# EasyEDA Pro project Series and Parallel Schematic Circuits.eprj

# Schematic Series Circuit
Board Name: Board1; Create Date: 2026-05-08; Page Name: P1; Project Name: Series and Parallel Schematic Circuits; Schematic Name: Series Circuit; Update Date: 2026-05-08; Company: EasyEDA.com; Page Size: A4; Version: V1.0
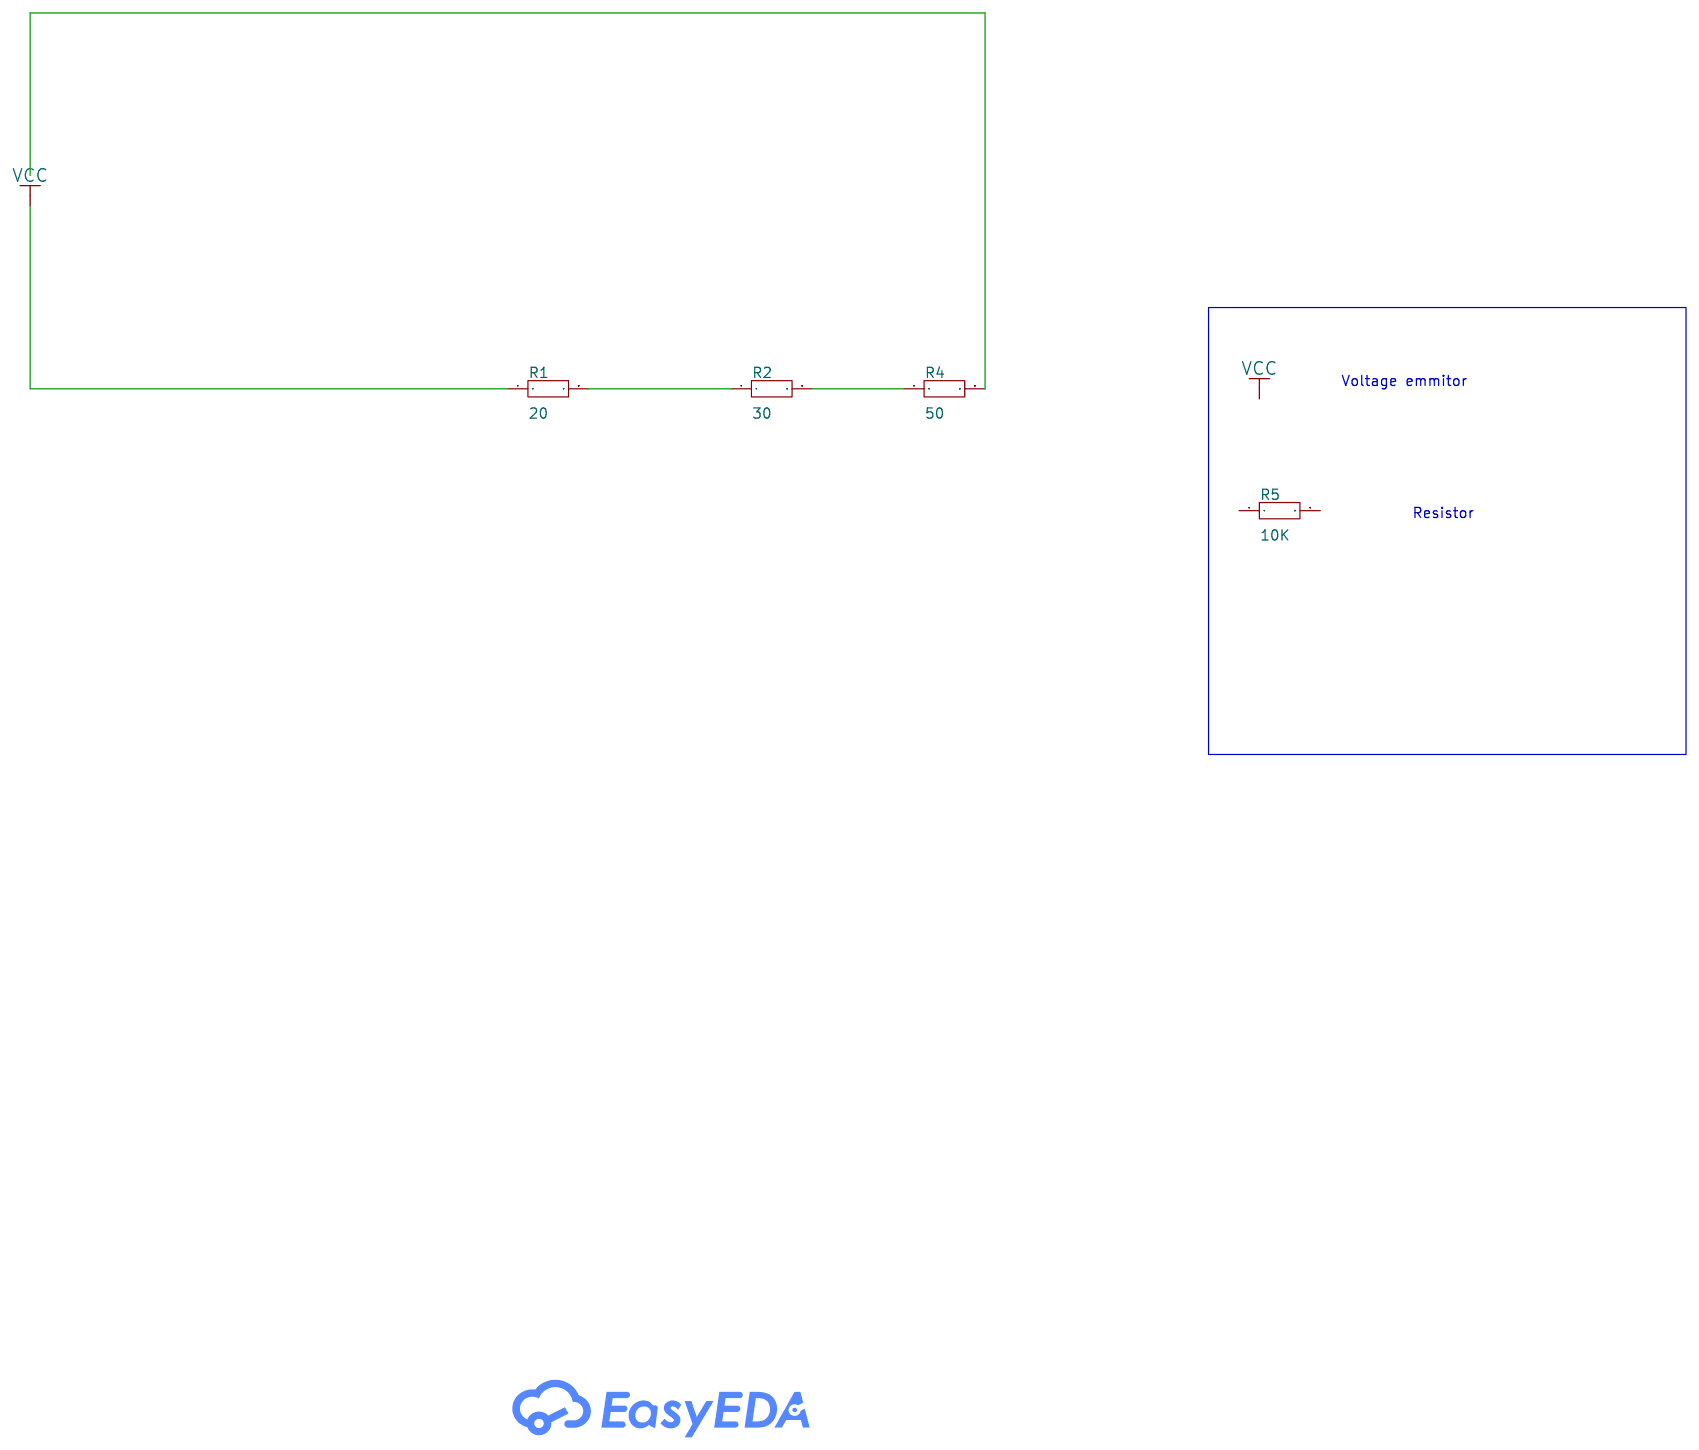
[diagram p0: schematic sheet]

## Parts
R1  20  [R0603]
R2  30  [R0603]
R4  50  [R0603]
R5  10K  [R0603]

## Library data of the parts
R1 R2 R4 R5 = Res_0603: Supplier Footprint: 0603

## Nets
VCC: R1.1
Net-(R1-2): R1.2 R2.1
Net-(R2-2): R2.2 R4.1

Not connected (* = marked no-connect by the designer): R4 2; R5 1 2

## Notes on the sheet
- Voltage emmitor
- Resistor

# Schematic Parallel Circuit
Board Name: Board2; Create Date: 2026-05-08; Page Name: P1; Project Name: Series and Parallel Schematic Circuits; Schematic Name: Parallel Circuit; Update Date: 2026-05-08; Company: EasyEDA.com; Page Size: A4; Version: V1.0
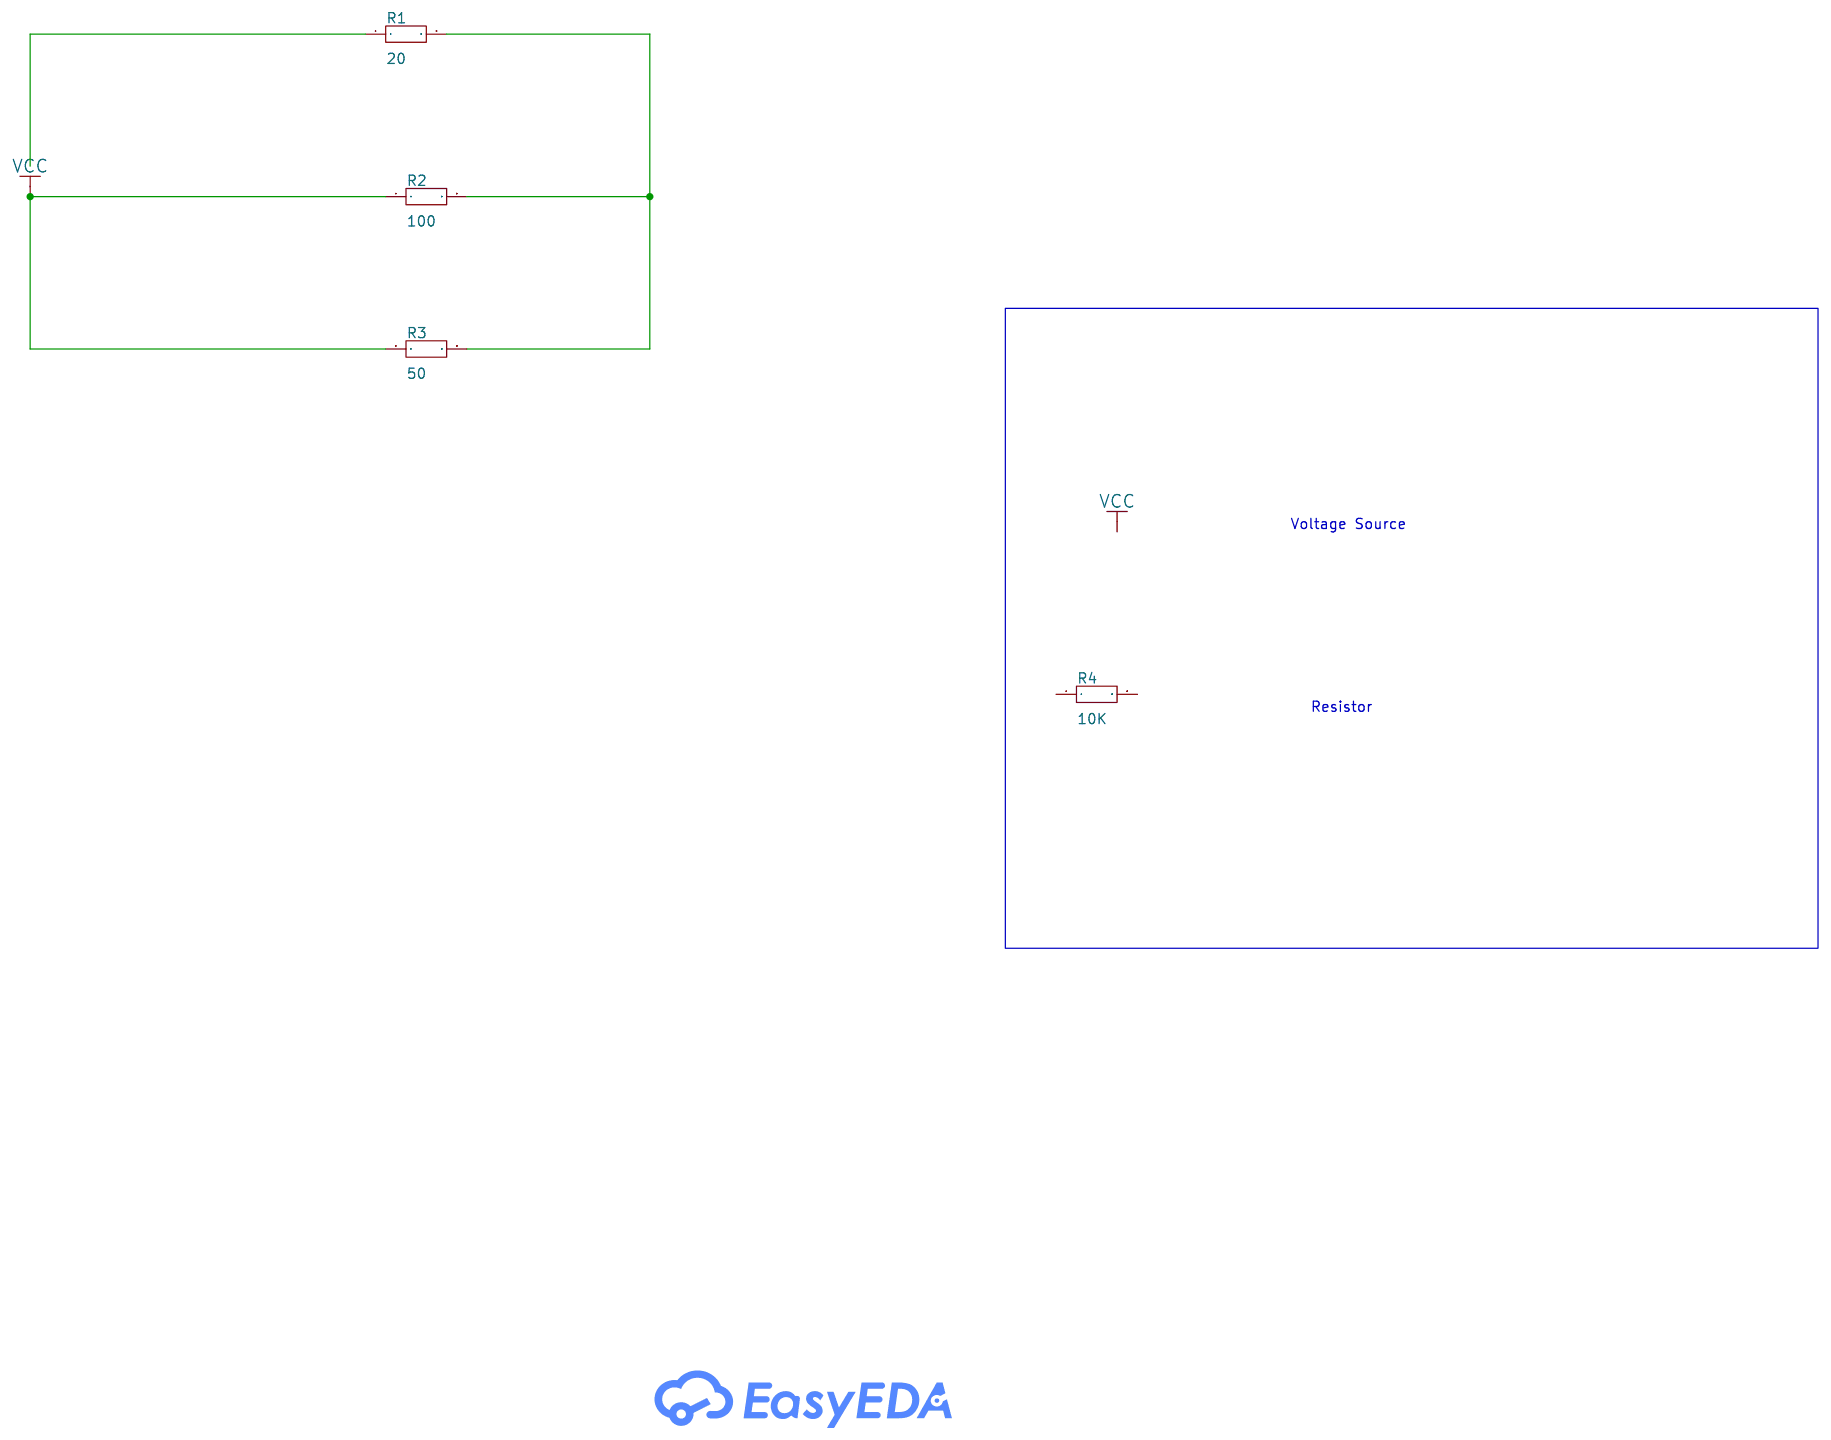
[diagram p1: schematic sheet]

## Parts
R1  20  [R0603]
R2  100  [R0603]
R3  50  [R0603]
R4  10K  [R0603]

## Library data of the parts
R1-R4 = Res_0603: Supplier Footprint: 0603

## Nets
VCC: R2.1 R3.1
Net-(R1-2): R1.2 R2.2 R3.2

Not connected (* = marked no-connect by the designer): R1 1; R4 1 2

## Notes on the sheet
- Voltage Source
- Resistor
